# Altium schematic sheet Connector_0.SchDoc
size A2; Date: Date; CompanyName: HESSO; Engineer: Name; Address1: Route du Rawyl 47; Address2: 1950 Sion; Address3: Switzerland; DocumentNumber: 4; SheetNumber: 4; SheetTotal: 8; ProjectName: Project Name
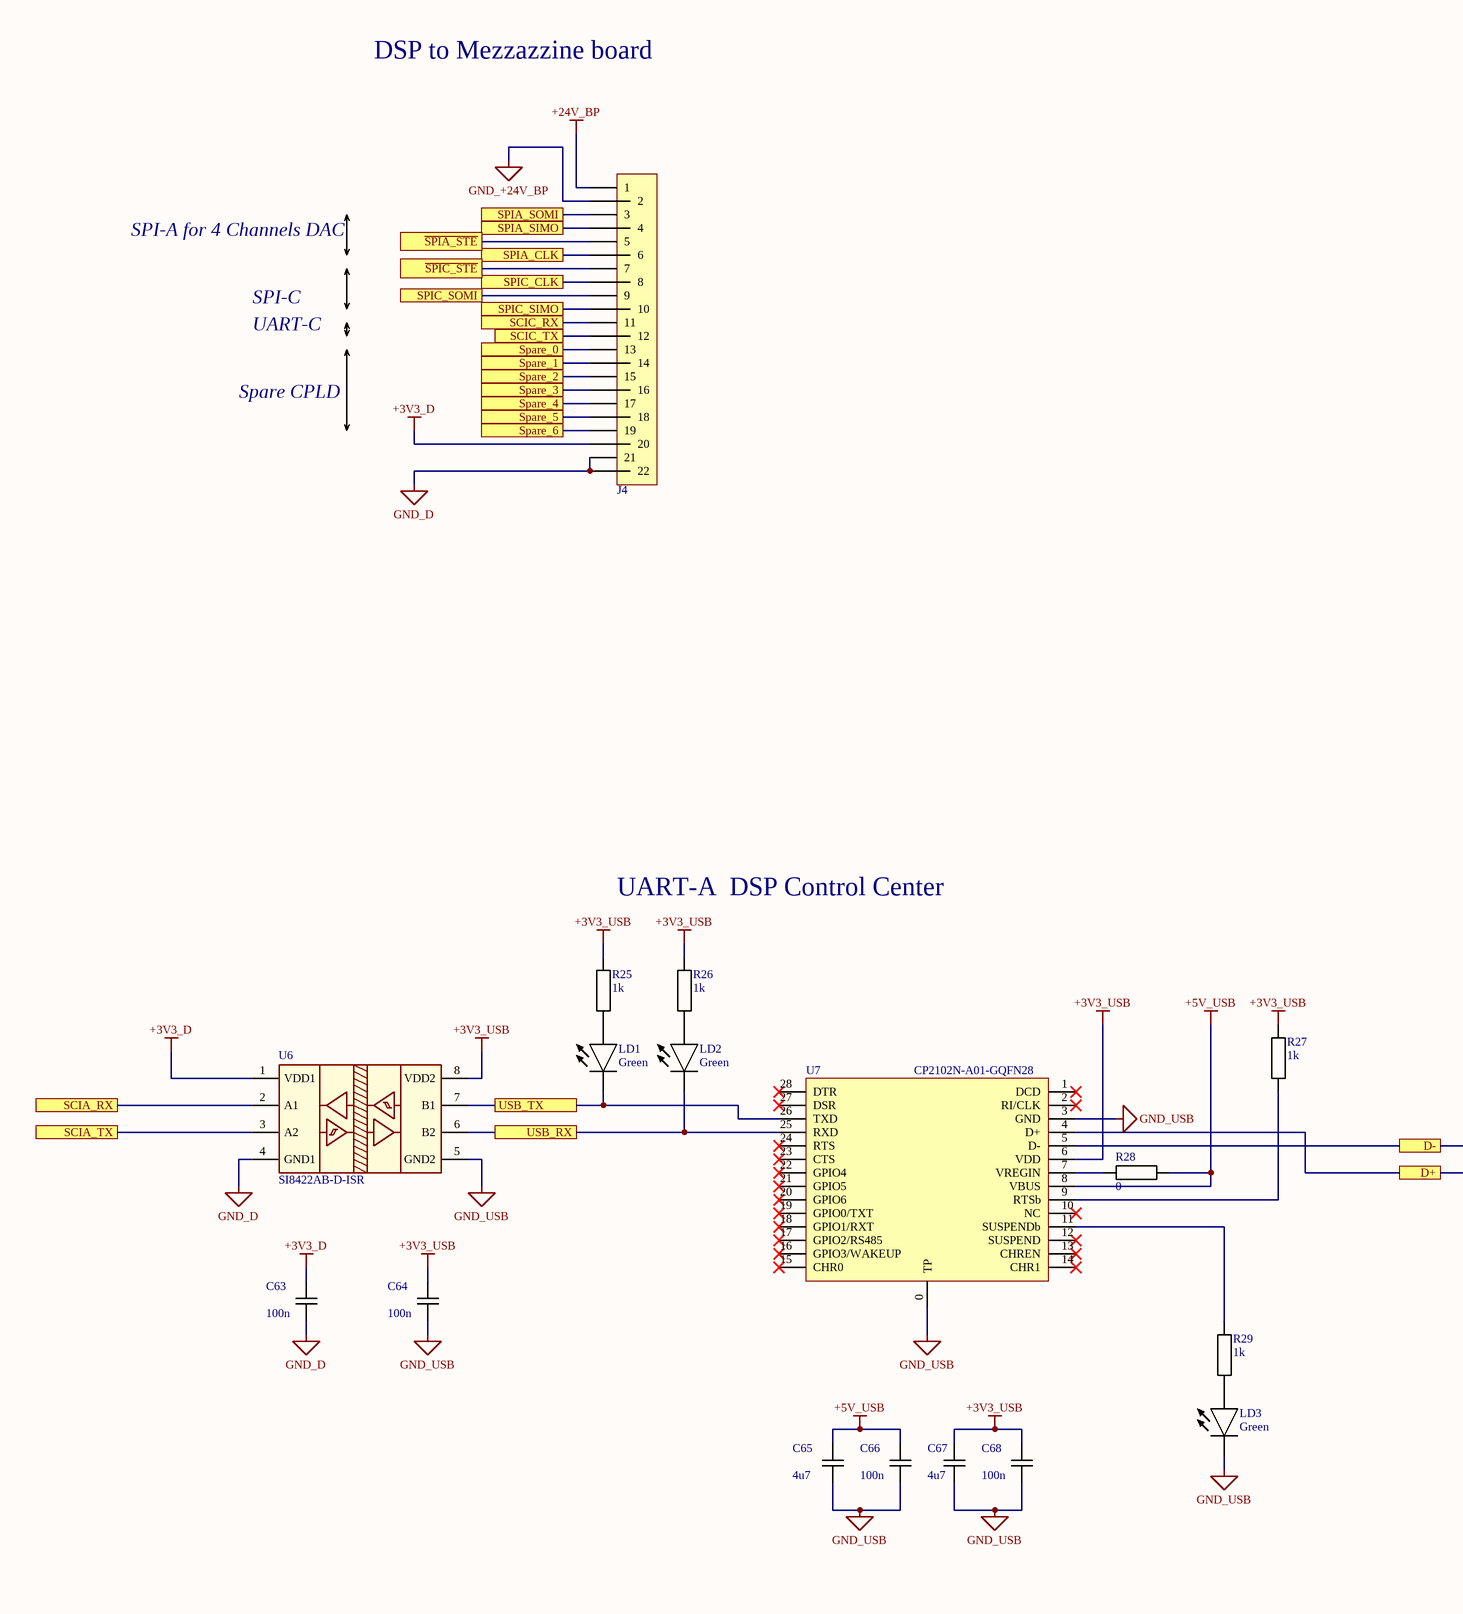
[diagram p0: Connector_0.SchDoc, left]
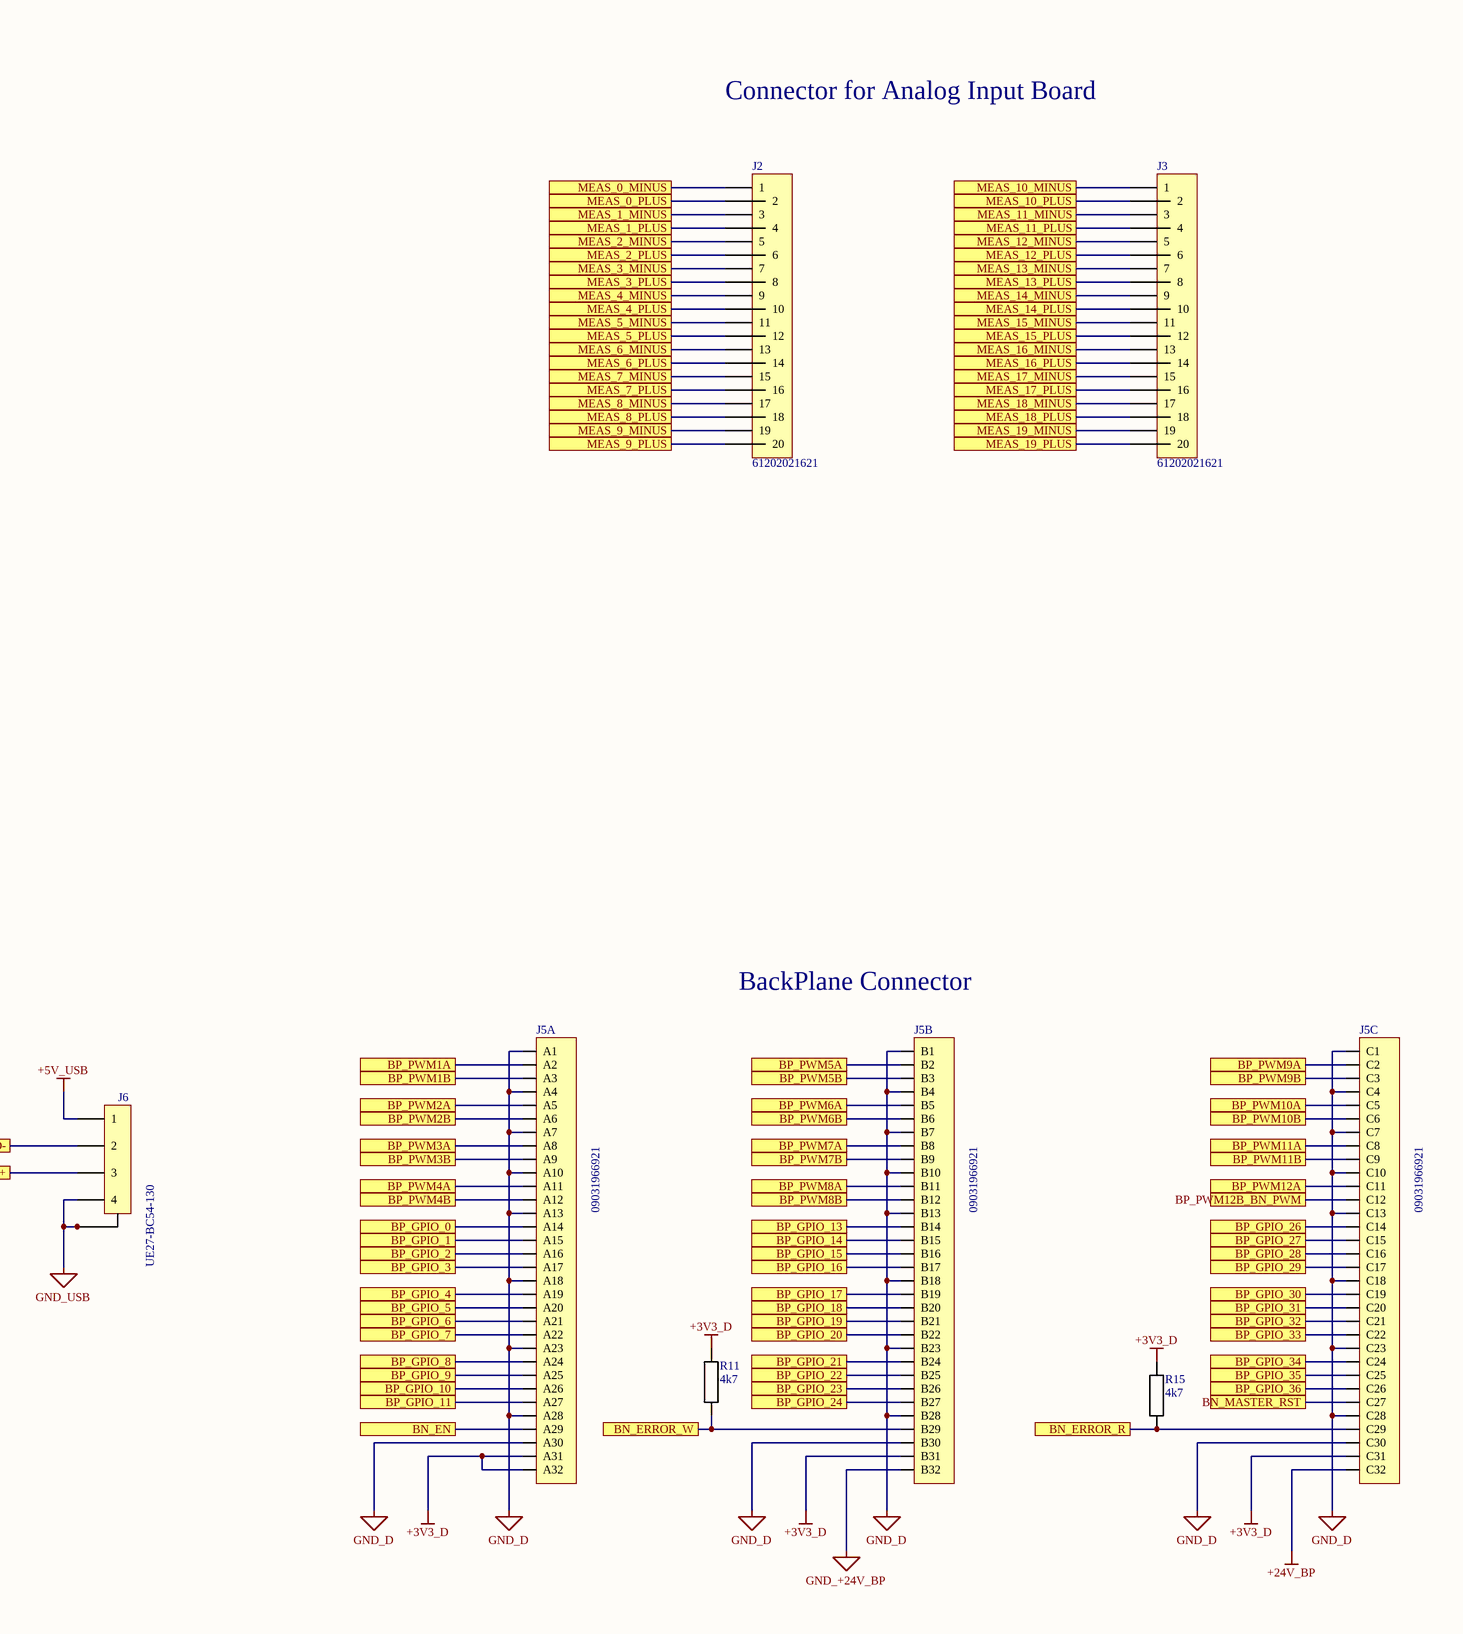
[diagram p1: Connector_0.SchDoc, right]

## Parts
C63  100n  [CAPACITOR 1608 REFLOW]
C64  100n  [CAPACITOR 1608 REFLOW]
C65  4u7  [CAPACITOR 2012 REFLOW]
C66  100n  [CAPACITOR 1608 REFLOW]
C67  4u7  [CAPACITOR 2012 REFLOW]
C68  100n  [CAPACITOR 1608 REFLOW]
J2  61202021621  [FlatCable2x10 2.54MM Straight TH]
J3  61202021621  [FlatCable2x10 2.54MM Straight TH]
J4  *  [PinHeader2x11 P2.54 A]  (value not drawn)
J5  09031966921  [DIN41612 MALE 3X32 ABC R90]  (parts A,B,C of 3)
J6  UE27-BC54-130  [USB-B TH AMPHENOL UE27-BC54-130]
LD1  Green  [LED 2012 REFLOW]
LD2  Green  [LED 2012 REFLOW]
LD3  Green  [LED 2012 REFLOW]
R11  4k7  [RESISTOR 1608 REFLOW]
R15  4k7  [RESISTOR 1608 REFLOW]
R25  1k  [RESISTOR 1608 REFLOW]
R26  1k  [RESISTOR 1608 REFLOW]
R27  1k  [RESISTOR 1608 REFLOW]
R28  0  [RESISTOR 1608 REFLOW]
R29  1k  [RESISTOR 1608 REFLOW]
U6  SI8422AB-D-ISR  [SO8 P1.27 C4.0X5.0 H1.75]
U7  CP2102N-A01-GQFN28  [QFN28 P0.5 T3.4X3.4 C5.0X5.0 H0.8]

## Ports
BN_EN, BN_ERROR_R, BN_ERROR_W, BN_MASTER_RST, BP_GPIO_0, BP_GPIO_1, BP_GPIO_2, BP_GPIO_3, BP_GPIO_4, BP_GPIO_5, BP_GPIO_6, BP_GPIO_7, BP_GPIO_8, BP_GPIO_9, BP_GPIO_10, BP_GPIO_11, BP_GPIO_13, BP_GPIO_14, BP_GPIO_15, BP_GPIO_16, BP_GPIO_17, BP_GPIO_18, BP_GPIO_19, BP_GPIO_20, BP_GPIO_21, BP_GPIO_22, BP_GPIO_23, BP_GPIO_24, BP_GPIO_26, BP_GPIO_27, BP_GPIO_28, BP_GPIO_29, BP_GPIO_30, BP_GPIO_31, BP_GPIO_32, BP_GPIO_33, BP_GPIO_34, BP_GPIO_35, BP_GPIO_36, BP_PWM1A, BP_PWM1B, BP_PWM2A, BP_PWM2B, BP_PWM3A, BP_PWM3B, BP_PWM4A, BP_PWM4B, BP_PWM5A, BP_PWM5B, BP_PWM6A, BP_PWM6B, BP_PWM7A, BP_PWM7B, BP_PWM8A, BP_PWM8B, BP_PWM9A, BP_PWM9B, BP_PWM10A, BP_PWM10B, BP_PWM11A, BP_PWM11B, BP_PWM12A, BP_PWM12B_BN_PWM, D+, D-, MEAS_0_MINUS, MEAS_0_PLUS, MEAS_1_MINUS, MEAS_1_PLUS, MEAS_2_MINUS, MEAS_2_PLUS, MEAS_3_MINUS, MEAS_3_PLUS, MEAS_4_MINUS, MEAS_4_PLUS, MEAS_5_MINUS, MEAS_5_PLUS, MEAS_6_MINUS, MEAS_6_PLUS, MEAS_7_MINUS, MEAS_7_PLUS, MEAS_8_MINUS, MEAS_8_PLUS, MEAS_9_MINUS, MEAS_9_PLUS, MEAS_10_MINUS, MEAS_10_PLUS, MEAS_11_MINUS, MEAS_11_PLUS, MEAS_12_MINUS, MEAS_12_PLUS, MEAS_13_MINUS, MEAS_13_PLUS, MEAS_14_MINUS, MEAS_14_PLUS, MEAS_15_MINUS, MEAS_15_PLUS, MEAS_16_MINUS, MEAS_16_PLUS, MEAS_17_MINUS, MEAS_17_PLUS, MEAS_18_MINUS, MEAS_18_PLUS, MEAS_19_MINUS, MEAS_19_PLUS, SCIA_RX, SCIA_TX, SCIC_RX, SCIC_TX, Spare_0, Spare_1, Spare_2, Spare_3, Spare_4, Spare_5, Spare_6, SPIA_CLK, SPIA_SIMO, SPIA_SOMI, SPIC_CLK, SPIC_SIMO, SPIC_SOMI, USB_RX, USB_TX, ~{SPIA_STE}, ~{SPIC_STE}

## Nets
+3V3_D: C63.2 J4.20 J5.A31 J5.A32 J5.B31 J5.C31 R11.2 R15.2 U6.1(VDD1)
+3V3_USB: C64.2 C67.2 C68.2 R25.2 R26.2 R27.2 U6.8(VDD2) U7.6(VDD)
+5V_USB: C65.2 C66.2 J6.1 R28.1 U7.8(VBUS)
+24V_BP: J4.1 J5.C32
GND_+24V_BP: J4.2 J5.B32
GND_D: C63.1 J4.21 J4.22 J5.A1 J5.A4 J5.A7 J5.A10 J5.A13 J5.A18 J5.A23 J5.A28 J5.A30 J5.B1 J5.B4 J5.B7 J5.B10 J5.B13 J5.B18 J5.B23 J5.B28 J5.B30 J5.C1 J5.C4 J5.C7 J5.C10 J5.C13 J5.C18 J5.C23 J5.C28 J5.C30 U6.4(GND1)
GND_USB: C64.1 C65.1 C66.1 C67.1 C68.1 J6.4 J6.5 J6.6 LD3.1(C) U6.5(GND2) U7.0(TP) U7.3(GND)
~{SPIA_STE}: J4.5 ; port ~{SPIA_STE}
~{SPIC_STE}: J4.7 ; port ~{SPIC_STE}
BN_EN: J5.A29 ; port BN_EN
BN_ERROR_R: J5.C29 R15.1 ; port BN_ERROR_R
BN_ERROR_W: J5.B29 R11.1 ; port BN_ERROR_W
BN_MASTER_RST: J5.C27 ; port BN_MASTER_RST
BP_GPIO_0: J5.A14 ; port BP_GPIO_0
BP_GPIO_1: J5.A15 ; port BP_GPIO_1
BP_GPIO_2: J5.A16 ; port BP_GPIO_2
BP_GPIO_3: J5.A17 ; port BP_GPIO_3
BP_GPIO_4: J5.A19 ; port BP_GPIO_4
BP_GPIO_5: J5.A20 ; port BP_GPIO_5
BP_GPIO_6: J5.A21 ; port BP_GPIO_6
BP_GPIO_7: J5.A22 ; port BP_GPIO_7
BP_GPIO_8: J5.A24 ; port BP_GPIO_8
BP_GPIO_9: J5.A25 ; port BP_GPIO_9
BP_GPIO_10: J5.A26 ; port BP_GPIO_10
BP_GPIO_11: J5.A27 ; port BP_GPIO_11
BP_GPIO_13: J5.B14 ; port BP_GPIO_13
BP_GPIO_14: J5.B15 ; port BP_GPIO_14
BP_GPIO_15: J5.B16 ; port BP_GPIO_15
BP_GPIO_16: J5.B17 ; port BP_GPIO_16
BP_GPIO_17: J5.B19 ; port BP_GPIO_17
BP_GPIO_18: J5.B20 ; port BP_GPIO_18
BP_GPIO_19: J5.B21 ; port BP_GPIO_19
BP_GPIO_20: J5.B22 ; port BP_GPIO_20
BP_GPIO_21: J5.B24 ; port BP_GPIO_21
BP_GPIO_22: J5.B25 ; port BP_GPIO_22
BP_GPIO_23: J5.B26 ; port BP_GPIO_23
BP_GPIO_24: J5.B27 ; port BP_GPIO_24
BP_GPIO_26: J5.C14 ; port BP_GPIO_26
BP_GPIO_27: J5.C15 ; port BP_GPIO_27
BP_GPIO_28: J5.C16 ; port BP_GPIO_28
BP_GPIO_29: J5.C17 ; port BP_GPIO_29
BP_GPIO_30: J5.C19 ; port BP_GPIO_30
BP_GPIO_31: J5.C20 ; port BP_GPIO_31
BP_GPIO_32: J5.C21 ; port BP_GPIO_32
BP_GPIO_33: J5.C22 ; port BP_GPIO_33
BP_GPIO_34: J5.C24 ; port BP_GPIO_34
BP_GPIO_35: J5.C25 ; port BP_GPIO_35
BP_GPIO_36: J5.C26 ; port BP_GPIO_36
BP_PWM1A: J5.A2 ; port BP_PWM1A
BP_PWM1B: J5.A3 ; port BP_PWM1B
BP_PWM2A: J5.A5 ; port BP_PWM2A
BP_PWM2B: J5.A6 ; port BP_PWM2B
BP_PWM3A: J5.A8 ; port BP_PWM3A
BP_PWM3B: J5.A9 ; port BP_PWM3B
BP_PWM4A: J5.A11 ; port BP_PWM4A
BP_PWM4B: J5.A12 ; port BP_PWM4B
BP_PWM5A: J5.B2 ; port BP_PWM5A
BP_PWM5B: J5.B3 ; port BP_PWM5B
BP_PWM6A: J5.B5 ; port BP_PWM6A
BP_PWM6B: J5.B6 ; port BP_PWM6B
BP_PWM7A: J5.B8 ; port BP_PWM7A
BP_PWM7B: J5.B9 ; port BP_PWM7B
BP_PWM8A: J5.B11 ; port BP_PWM8A
BP_PWM8B: J5.B12 ; port BP_PWM8B
BP_PWM9A: J5.C2 ; port BP_PWM9A
BP_PWM9B: J5.C3 ; port BP_PWM9B
BP_PWM10A: J5.C5 ; port BP_PWM10A
BP_PWM10B: J5.C6 ; port BP_PWM10B
BP_PWM11A: J5.C8 ; port BP_PWM11A
BP_PWM11B: J5.C9 ; port BP_PWM11B
BP_PWM12A: J5.C11 ; port BP_PWM12A
BP_PWM12B_BN_PWM: J5.C12 ; port BP_PWM12B_BN_PWM
D+: J6.3 U7.4(D+) ; port D+
D-: J6.2 U7.5(D-) ; port D-
MEAS_0_MINUS: J2.1 ; port MEAS_0_MINUS
MEAS_0_PLUS: J2.2 ; port MEAS_0_PLUS
MEAS_1_MINUS: J2.3 ; port MEAS_1_MINUS
MEAS_1_PLUS: J2.4 ; port MEAS_1_PLUS
MEAS_2_MINUS: J2.5 ; port MEAS_2_MINUS
MEAS_2_PLUS: J2.6 ; port MEAS_2_PLUS
MEAS_3_MINUS: J2.7 ; port MEAS_3_MINUS
MEAS_3_PLUS: J2.8 ; port MEAS_3_PLUS
MEAS_4_MINUS: J2.9 ; port MEAS_4_MINUS
MEAS_4_PLUS: J2.10 ; port MEAS_4_PLUS
MEAS_5_MINUS: J2.11 ; port MEAS_5_MINUS
MEAS_5_PLUS: J2.12 ; port MEAS_5_PLUS
MEAS_6_MINUS: J2.13 ; port MEAS_6_MINUS
MEAS_6_PLUS: J2.14 ; port MEAS_6_PLUS
MEAS_7_MINUS: J2.15 ; port MEAS_7_MINUS
MEAS_7_PLUS: J2.16 ; port MEAS_7_PLUS
MEAS_8_MINUS: J2.17 ; port MEAS_8_MINUS
MEAS_8_PLUS: J2.18 ; port MEAS_8_PLUS
MEAS_9_MINUS: J2.19 ; port MEAS_9_MINUS
MEAS_9_PLUS: J2.20 ; port MEAS_9_PLUS
MEAS_10_MINUS: J3.1 ; port MEAS_10_MINUS
MEAS_10_PLUS: J3.2 ; port MEAS_10_PLUS
MEAS_11_MINUS: J3.3 ; port MEAS_11_MINUS
MEAS_11_PLUS: J3.4 ; port MEAS_11_PLUS
MEAS_12_MINUS: J3.5 ; port MEAS_12_MINUS
MEAS_12_PLUS: J3.6 ; port MEAS_12_PLUS
MEAS_13_MINUS: J3.7 ; port MEAS_13_MINUS
MEAS_13_PLUS: J3.8 ; port MEAS_13_PLUS
MEAS_14_MINUS: J3.9 ; port MEAS_14_MINUS
MEAS_14_PLUS: J3.10 ; port MEAS_14_PLUS
MEAS_15_MINUS: J3.11 ; port MEAS_15_MINUS
MEAS_15_PLUS: J3.12 ; port MEAS_15_PLUS
MEAS_16_MINUS: J3.13 ; port MEAS_16_MINUS
MEAS_16_PLUS: J3.14 ; port MEAS_16_PLUS
MEAS_17_MINUS: J3.15 ; port MEAS_17_MINUS
MEAS_17_PLUS: J3.16 ; port MEAS_17_PLUS
MEAS_18_MINUS: J3.17 ; port MEAS_18_MINUS
MEAS_18_PLUS: J3.18 ; port MEAS_18_PLUS
MEAS_19_MINUS: J3.19 ; port MEAS_19_MINUS
MEAS_19_PLUS: J3.20 ; port MEAS_19_PLUS
SCIA_RX: U6.2(A1) ; port SCIA_RX
SCIA_TX: U6.3(A2) ; port SCIA_TX
SCIC_RX: J4.11 ; port SCIC_RX
SCIC_TX: J4.12 ; port SCIC_TX
Spare_0: J4.13 ; port Spare_0
Spare_1: J4.14 ; port Spare_1
Spare_2: J4.15 ; port Spare_2
Spare_3: J4.16 ; port Spare_3
Spare_4: J4.17 ; port Spare_4
Spare_5: J4.18 ; port Spare_5
Spare_6: J4.19 ; port Spare_6
SPIA_CLK: J4.6 ; port SPIA_CLK
SPIA_SIMO: J4.4 ; port SPIA_SIMO
SPIA_SOMI: J4.3 ; port SPIA_SOMI
SPIC_CLK: J4.8 ; port SPIC_CLK
SPIC_SIMO: J4.10 ; port SPIC_SIMO
SPIC_SOMI: J4.9 ; port SPIC_SOMI
USB_RX: LD2.1(C) U6.6(B2) U7.25(RXD) ; port USB_RX
USB_TX: LD1.1(C) U6.7(B1) U7.26(TXD) ; port USB_TX
NetLD1_2: LD1.2(A) R25.1
NetLD2_2: LD2.2(A) R26.1
NetLD3_2: LD3.2(A) R29.1
NetR27_1: R27.1 U7.9(RTSb)
NetR28_2: R28.2 U7.7(VREGIN)
NetR29_2: R29.2 U7.11(SUSPENDb)

Not connected (* = marked no-connect by the designer): U7 1(DCD)* 2(RI/CLK)* 10(NC)* 12(SUSPEND)* 13(CHREN)* 14(CHR1)* 15(CHR0)* 16(GPIO3/WAKEUP)* 17(GPIO2/RS485)* 18(GPIO1/RXT)* 19(GPIO0/TXT)* 20(GPIO6)* 21(GPIO5)* 22(GPIO4)* 23(CTS)* 24(RTS)* 27(DSR)* 28(DTR)*

## Notes on the sheet
- DSP to Mezzazzine board
- Connector for Analog Input Board
- SPI-A for 4 Channels DAC
- UART-C
- SPI-C
- Spare CPLD
- UART-A  DSP Control Center
- BackPlane Connector
- Date :
- Revision :
- Sheet
- of
- Design by :

## Library data of the parts
C63 C64 C66 C68 = Capacitor: Capacitor X7R 10% 50V 1608(0603); Value: 100n
C65 C67 = Capacitor: Capacitor X7R 10% 10V 2012(0805); Value: 4u7
J2 J3 = FlatCable2x10: Manufacturer: Wurth Elektronik; Mouser No.: 710-61202021621; Value: 61202021621
J4 = PinHeader2x11: Plug connector; Value: *
J5 = DIN41612 MALE 3X32 ABC R90: Manufacturer: Harting; Mouser No.: 617-09-03-196-6921; Value: 09031966921
J6 = USB-B-TH-AMPHENOL UE27-BC54-130: Manufacturer: Amphenol ICC; Mouser No.: 523-UE27-BC54-130; Value: UE27-BC54-130
LD1-LD3 = LED: LED generic; Value: Green
R11 R15 R25-R29 = Resistor: Resistor 1% 50V 100mW 1608(0603)
  R11 R15: Value: 4k7
  R25-R27 R29: Value: 1k
  R28: Value: 0
U6 = SI8422: Optocoupler; Manufacturer: Silicon Labs; Value: SI8422AB-D-ISR; Mouser No.: 634-SI8422AB-D-ISR
U7 = CP2102N: USBXpress; Manufacturer: Silicon Labs; Value: CP2102N-A01-GQFN28; Mouser No.: 634-CP2102NA01GQFN28